# Altium schematic sheet UsbToUart.SchDoc
size A4 portrait; Address1: 00-<Schema Name>; DocumentNumber: 1; SheetNumber: 3; SheetTotal: 5; ModifiedBy: -; RevisionDate: -; Size: A3
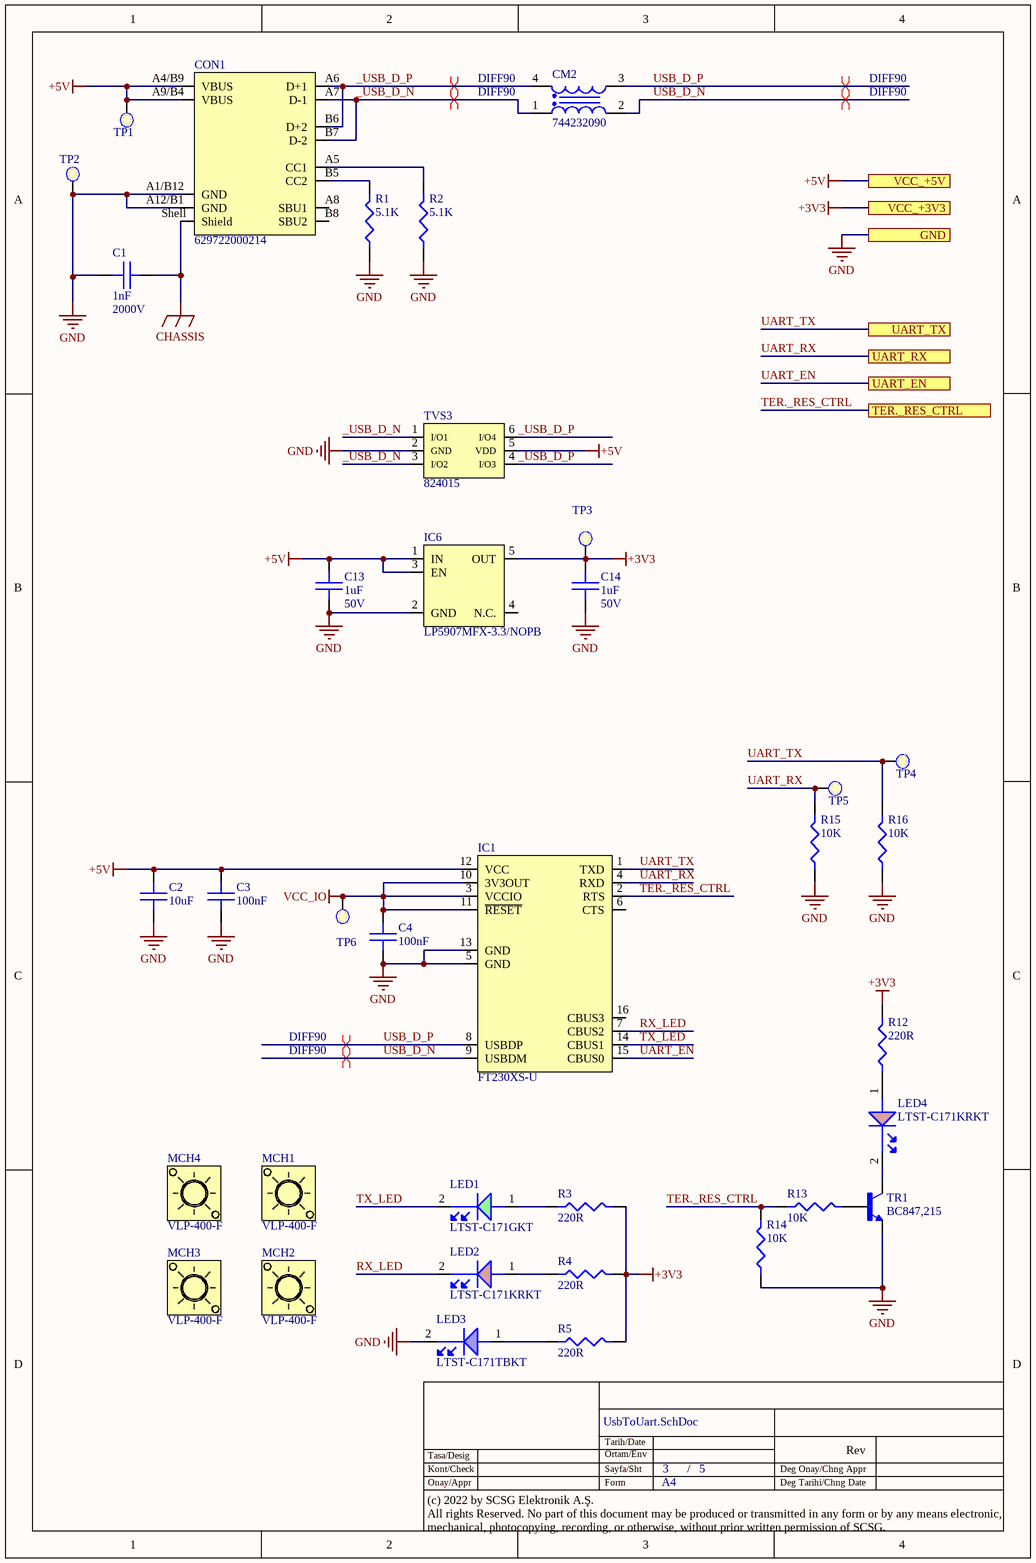
[diagram p0: UsbToUart.SchDoc]

## Parts
C1  1nF  Voltage Rating: 2000V  [C1206]
C2  10uF  [C0805]
C3  100nF  [C0603]
C4  100nF  [C0603]
C13  1uF  Voltage Rating: 50V  [C0603]
C14  1uF  Voltage Rating: 50V  [C0603]
CM2  744232090  [WE-CNSW_1206]
CON1  629722000214  [629722000214]
IC1  FT230XS-U  [SSOP-16]
IC6  LP5907MFX-3.3/NOPB  [SOT23-5]
LED1  LTST-C171GKT  [0805_green]
LED2  LTST-C171KRKT  [0805_RED]
LED3  LTST-C171TBKT  [0805_blue]
LED4  LTST-C171KRKT  [0805_RED]
MCH1  VLP-400-F  [VLP-400-F]
MCH2  VLP-400-F  [VLP-400-F]
MCH3  VLP-400-F  [VLP-400-F]
MCH4  VLP-400-F  [VLP-400-F]
R1  5.1K  [R0402]
R2  5.1K  [R0402]
R3  220R  [R0603]
R4  220R  [R0603]
R5  220R  [R0603]
R12  220R  [R0603]
R13  10K  [R0603]
R14  10K  [R0603]
R15  10K  [R0603]
R16  10K  [R0603]
TP1  TestPoint1  [SMD_1mmPoint]  (value not drawn)  (no BOM)
TP2  TestPoint1  [SMD_1mmPoint]  (value not drawn)  (no BOM)
TP3  TestPoint1  [SMD_1mmPoint]  (value not drawn)  (no BOM)
TP4  TestPoint1  [SMD_1mmPoint]  (value not drawn)  (no BOM)
TP5  TestPoint1  [SMD_1mmPoint]  (value not drawn)  (no BOM)
TP6  TestPoint1  [SMD_1mmPoint]  (value not drawn)  (no BOM)
TR1  BC847,215  [SOT23-3]
TVS3  824015  [SOT-23-6]

## Ports
GND, TER._RES_CTRL, UART_EN, UART_RX, UART_TX, VCC_+3V3, VCC_+5V

## Nets
+3V3: C14.2 IC6.5(OUT) R3.2 R4.2 R5.2 R12.2 TP3.1 ; port VCC_+3V3
+5V: C2.2 C3.2 C13.2 CON1.A4/B9(VBUS) CON1.A9/B4(VBUS) IC1.12(VCC) IC6.1(IN) IC6.3(EN) TP1.1 TVS3.5(VDD) ; port VCC_+5V
CHASSIS: C1.2 CON1.Shell(Shield)
GND: C1.1 C2.1 C3.1 C4.1 C13.1 C14.1 CON1.A1/B12(GND) CON1.A12/B1(GND) IC1.5(GND) IC1.13(GND) IC6.2(GND) LED3.2 R1.1 R2.1 R14.1 R15.1 R16.1 TP2.1 TR1.2(E) TVS3.2(GND) ; port GND
VCC_IO: C4.2 IC1.3(VCCIO) IC1.10(3V3OUT) IC1.11(~{RESET}) TP6.1
_USB_D_N: CM2.1 CON1.A7(D-1) CON1.B7(D-2) TVS3.1(I/O1) TVS3.3(I/O2)
_USB_D_P: CM2.4 CON1.A6(D+1) CON1.B6(D+2) TVS3.4(I/O3) TVS3.6(I/O4)
RX_LED: IC1.7(CBUS2) LED2.2
TER._RES_CTRL: IC1.2(RTS) R13.1 R14.2 ; port TER._RES_CTRL
TX_LED: IC1.14(CBUS1) LED1.2
UART_EN: IC1.15(CBUS0) ; port UART_EN
UART_RX: IC1.4(RXD) R15.2 TP5.1 ; port UART_RX
UART_TX: IC1.1(TXD) R16.2 TP4.1 ; port UART_TX
USB_D_N: CM2.2 IC1.9(USBDM)
USB_D_P: CM2.3 IC1.8(USBDP)
NetCON1_A5: CON1.A5(CC1) R2.2
NetCON1_B5: CON1.B5(CC2) R1.2
NetLED1_1: LED1.1 R3.1
NetLED2_1: LED2.1 R4.1
NetLED3_1: LED3.1 R5.1
NetLED4_1: LED4.1 R12.1
NetLED4_2: LED4.2 TR1.3(C)
NetR13_2: R13.2 TR1.1(B)

Not connected (* = marked no-connect by the designer): CON1 A8(SBU1) B8(SBU2); IC1 6(CTS) 16(CBUS3); IC6 4(N.C.)

## Layout directives
differential pair; net class DIFF90: _USB_D_N, _USB_D_P, USB_D_N, USB_D_P

## Notes on the sheet
- Tarih/Date
- Tasa/Desig
- Kont/Check
- Onay/Appr
- Sayfa/Sht
- Form
- Ortam/Env
- A4
- /
- Deg Tarihi/Chng Date
- Deg Onay/Chng Appr
- Rev
- (c) 2022 by SCSG Elektronik A.Ş.
  All rights Reserved. No part of this document may be produced or transmitted in any form or by any means electronic, mechanical, photocopying, recording, or otherwise, without prior written permission of SCSG.

## Library data of the parts
C1 = CS1206KKX7RDBB102: 1nF, 2kV, X7R, 1206; Manufacturer: Yageo; Dielectric Material: Ceramic; Purpose Of Usage: USB_to_UART; Tolerance: 10%; Value: 1000; Working Voltage: 0; Manufacturer Part Number: CS1206KKX7RDBB102; RoHS: YES; Category: CAPASITOR; Case/Package: 1206; Case Code (Imperial): 1206; Case Code (Metric): 3216; Dielectric: X7R; Height: 1.45mm; Local Supplier: GENERAL; Max Operating Temperature: 125°C; Min Operating Temperature: -55°C; Mount: SMD; Price 10K: 0.5; Stock ID: ??; Sub-Category: CERAMIC; Supplier 1: Digi-Key; Supplier Part Number 1: 13-CS1206KKX7RDBB102TR-ND; Voltage Rating (DC): 2000V
C2 = CC0805KFX7R6BB106: 10uF ,10V ,X7R ,0805; Manufacturer: Yageo; Value: 10000000; Dielectric Material: Ceramic; Tolerance: 10%; Purpose Of Usage: USB_to_UART; Working Voltage: 0; Supplier 1: Digi-Key; Manufacturer Part Number: CC0805KFX7R6BB106; RoHS: YES; Supplier Part Number 1: 13-CC0805KFX7R6BB106CT-ND; Category: CAPASITOR; Sub-Category: CERAMIC; Case/Package: 0805; Case Code (Imperial): 0805; Case Code (Metric): 2012; Dielectric: X7R; Max Operating Temperature: 125°C; Min Operating Temperature: -55°C; Mount: SMD; Stock ID: ??; Voltage Rating (DC): 10V; Voltage Rating: 10V; Local Supplier: GENERAL; Price 10K: 0.00250
C3 C4 = CC0603KRX7R8BB104: 100nF, 25V, X7R, 0603; Manufacturer: Yageo; Value: 100000; Tolerance: 10%; Dielectric Material: Ceramic; Purpose Of Usage: USB_to_UART; Working Voltage: 0; Supplier 1: Digi-Key; Supplier Part Number 1: 311-1341-1-ND; Manufacturer Part Number: CC0603KRX7R8BB104; RoHS: YES; Mount: SMD; Case/Package: 0603; Case Code (Imperial): 0603; Case Code (Metric): 1608; Min Operating Temperature: -55°C; Max Operating Temperature: 125°C; Voltage Rating: 25V; Voltage Rating (DC): 25V; Dielectric: X7R; Height: 0.8mm; Category: CAPASITOR; Sub-Category: CERAMIC; Stock ID: ??; Local Supplier: GENERAL; Price 10K: 0.00250
C13 C14 = CC0603KRX7R9BB105: 1uF, 50V, X7R, 0603; Manufacturer: Yageo; Value: 1000000; Tolerance: 10%; Dielectric Material: Ceramic; Purpose Of Usage: USB_to_UART; Working Voltage: 0; Manufacturer Part Number: CC0603KRX7R9BB105; RoHS: YES; Category: CAPASITOR; Case/Package: 0603; Case Code (Metric): 1608; Case Code (Imperial): 0603; Min Operating Temperature: -55°C; Max Operating Temperature: 125°C; Dielectric: X7R; Voltage Rating (DC): 50V; Height: 0.95mm; Local Supplier: GENERAL; Mount: SMD; MSL: 1; Price 10K: 0.00250; Stock ID: ??; Sub-Category: CERAMIC; Supplier 1: Digi-Key; Supplier Part Number 1: 311-2082-2-ND
CM2 = 744232090: Common Mode Chokes Dual 90Ohm 100MHz 370mA SMD T/R; Manufacturer: Wurth Electronics; Value: 3.3H; DC Resistance (DCR): 300mR; Inductance Tolerance: 25%; Purpose Of Usage: USB_to_UART; Supplier 1: Digi-Key; Supplier Part Number 1: 732-1469-1-ND; Manufacturer Part Number: 744232090; RoHS: YES; Mount: SMD; Case/Package: SMD/SMT; Min Operating Temperature: -40°C; Max Operating Temperature: 125°C; Current Rating: 370mA; Length: 3.2mm; Category: INDUCTORS; Sub-Category: COMMON MODE CHOKES; Stock ID: ??
CON1 = 629722000214: Wr-com_usb 2.0_TYPE C_horizontal; Manufacturer: Wurth Elektronik; Gender: Receptacle; Number of Contacts: 16; Purpose Of Usage: USB_to_UART; Manufacturer Part Number: 629722000214; Category: CONNECTORS; Local Supplier: WURTH; Max Operating Temperature: 85°C; Min Operating Temperature: -40°C; Mount: SMD; Orientation: Right Angle; RoHS: Yes; Stock ID: ??; Sub-Category: USB Type-C; Supplier 1: Digi-Key; Supplier Part Number 1: 732-629722000214TR-ND
IC1 = FT230XS-U: USB Interface IC USB to Basic Serial UART IC SSOP-16; Manufacturer: FTDI; Purpose Of Usage: USB_to_UART; Supplier 1: Digi-Key; Manufacturer Part Number: FT230XS-U; Stock 1: 4799; RoHS: YES; Case/Package: SSOP; Package Quantity: 100; Lead Free: Lead Free; Category: INTEGRATED CIRCUITS; Supplier Part Number 1: 768-1154-5-ND; Sub-Category: USB to UART; Mount: SMD; Stock ID: ??
IC6 = LP5907MFX-3.3/NOPB: Linear Voltage Regulator IC Positive Fixed 1 Output 250mA SOT-23-5; Manufacturer: TEXAS; Purpose Of Usage: USB_to_UART; Topology: LDO; Max Supply Voltage: 5.5V; Min Supply Voltage: 3.6V; Supplier 1: Digi-Key; Manufacturer Part Number: LP5907MFX-3.3/NOPB; Stock 1: 5836; RoHS: YES; Mount: SMD; Case/Package: SOT-23-5; Package Quantity: 3000; Lead Free: Lead Free; Category: INTEGRATED CIRCUITS; Sub-Category: PMIC - LINEAR REGULATOR; Supplier Part Number 1: 296-38557-2-ND; Stock ID: ??; Max Operating Temperature: +125; Min Operating Temperature: -40; MSL: 1
LED1 = LTST-C171GKT: LED GREEN CLEAR CHIP SMD; Manufacturer: Vishay Lite-On; Purpose Of Usage: USB_to_UART; Supplier 1: Digi-Key; Supplier Part Number: 160-1423-1-ND; Manufacturer Part Number: LTST-C171GKT; RoHS: YES; Mount: SMD; Case/Package: 0805; Color: Green; Min Operating Temperature: -55°C; Max Operating Temperature: 85°C; Category: DIODE; Sub-Category: LED; Stock ID: ??; Supplier Part Number 1: 160-1423-1-ND
LED2 LED4 = LTST-C171KRKT: LED RED CLEAR SMD; Manufacturer: Vishay Lite-On; Purpose Of Usage: USB_to_UART; Supplier 1: Digi-Key; Supplier Part Number 1: 160-1427-1-ND; Manufacturer Part Number: LTST-C171KRKT; RoHS: YES; Mount: SMD; Case/Package: 0805; Color: Red; Min Operating Temperature: -55°C; Max Operating Temperature: 85°C; Category: DIODE; Sub-Category: LED; Stock ID: ??
LED3 = LTST-C171TBKT: LED BLUE CLEAR CHIP SMD; Manufacturer: Vishay Lite-On; Purpose Of Usage: USB_to_UART; Supplier 1: Digi-Key; Supplier Part Number 1: 160-1645-1-ND; Manufacturer Part Number: LTST-C171TBKT; RoHS: YES; Mount: SMD; Case/Package: 0805; Color: Blue; Min Operating Temperature: -20°C; Max Operating Temperature: 80°C; Category: DIODE; Sub-Category: LED; Stock ID: ??
MCH1-MCH4 = VLP-400-F: Bivar straight light guide, rigidity, PCBinstall, 4.1 x 4.1 x 10.2mm; Element Configuration: Single; Purpose Of Usage: USB_to_UART; Manufacturer: Bivar; Manufacturer Part Number: VLP-400-F; RoHS: YES; Category: MECHANICAL; Length: 10.16mm; Material: PC, Polycarbonate; Mounting Technology: PCB; Local Supplier: Bivar; Mount: MECH; Stock ID: ??; Sub-Category: LED PIPE; Supplier 1: Digi-Key; Supplier Part Number 1: 492-1516-ND
R1 R2 = RC0402FR-075K1L: 5.1K, %1, 1/16W, 0402; Manufacturer: YAGEO; Max Power Dissipation: 63mW; Power Rating: 62.5mW; Value: 5100; Temperature Coefficient: 100ppm/°C; Tolerance: 1%; Voltage Rating: 50V; Purpose Of Usage: USB_to_UART; Manufacturer Part Number: RC0402FR-075K1L; RoHS: Compliant; Category: RESISTOR; Case/Package: 0402; Case Code (Imperial): 0402; Max Operating Temperature: 155°C; Min Operating Temperature: -55°C; Voltage Rating (DC): 50V; Working Voltage: 50V; Local Supplier: GENERAL; Mount: SMD; Price 10K: 0.0025; Stock ID: ??; Sub-Category: CHIP RESISTOR; Supplier 1: Digi-Key; Supplier Part Number 1: 311-5.10KLRTR-ND
R3-R5 R12 = RC0603FR-07220RL: 220R, %1, 1/10W, 0603; Manufacturer: YAGEO; Value: 220; Tolerance: 1%; Voltage Rating (DC): 50V; Temperature Coefficient: 100ppm/°C; Power Rating: 100mW; Purpose Of Usage: USB_to_UART; Supplier 1: Digi-Key; Supplier Part Number 1: 311-220HRCT-ND; Manufacturer Part Number: RC0603FR-07220RL; RoHS: YES; Case/Package: 0603; Case Code (Imperial): 0603; Min Operating Temperature: -55°C; Max Operating Temperature: 155°C; Voltage Rating: 50V; Max Power Dissipation: 100mW; Category: RESISTOR; Sub-Category: CHIP RESISTOR; Stock ID: ??; Mount: SMD; Price 10K: 0.0025; Local Supplier: GENERAL
R13-R16 = RT0603FRE0710KL: 10K, %1, 1/10W, 0603; Manufacturer: YAGEO; Value: 10000; Tolerance: 1%; Power Rating: 100mW; Voltage Rating: 75V; Temperature Coefficient: 50ppm/°C; Purpose Of Usage: USB_to_UART; Supplier 1: Digi-Key; Supplier Part Number 1: YAG2321CT-ND; Manufacturer Part Number: RT0603FRE0710KL; RoHS: YES; Case/Package: 0603; Case Code (Imperial): 0603; Min Operating Temperature: -55°C; Max Operating Temperature: 125°C; Max Power Dissipation: 100mW; Voltage Rating (DC): 75V; Category: RESISTOR; Supplier 2: JLCPCB; Supplier Part Number 2: C25804; Sub-Category: CHIP RESISTOR; Stock ID: ??; Mount: SMD; Price 10K: 0.0025; Local Supplier: GENERAL
TP1-TP6 = TestPoint1: test ölçüm noktası; Manufacturer: NO BOM DEVICE; Purpose Of Usage: USB_to_UART; Category: CONNECTORS; Sub-Category: TEST POINT; Manufacturer Part Number: NO BOM DEVICE; Stock ID: ??
TR1 = BC847,215: TRANS NPN 45V 0.1A SOT23; Manufacturer: Nexperia; Purpose Of Usage: USB_to_UART; Supplier 1: Digi-Key; Supplier Part Number 1: 1727-4855-1-ND; Manufacturer Part Number: BC847,215; RoHS: NO; Category: TRANSISTOR; Case/Package: SOT-23-3; Max Operating Temperature: 150°C; Min Operating Temperature: -55°C; Mount: SMD; Sub-Category: NPN; Stock ID: ??; Price 10K: 0.021; Local Supplier: OZDISAN
TVS3 = 824015: WURTH ELEKTRONIK - 824015 - TVS Diode, 82401 Series, Bidirectional, 5 V, 13 V, SOT-23, 6 Pins; Manufacturer: Wurth Electronics; Direction: UNI; Clamping Voltage: 7.8V; Purpose Of Usage: USB_to_UART; Supplier 1: Digi-Key; Supplier Part Number 1: 732-4467-1-ND; Manufacturer Part Number: 824015; RoHS: YES; Mount: SMD; Case/Package: SOT-23-6; Min Operating Temperature: -55°C; Max Operating Temperature: 125°C; Category: DIODE; Sub-Category: TVS; Stock ID: ??